# Altium schematic sheet ov2640.SchDoc
size A4
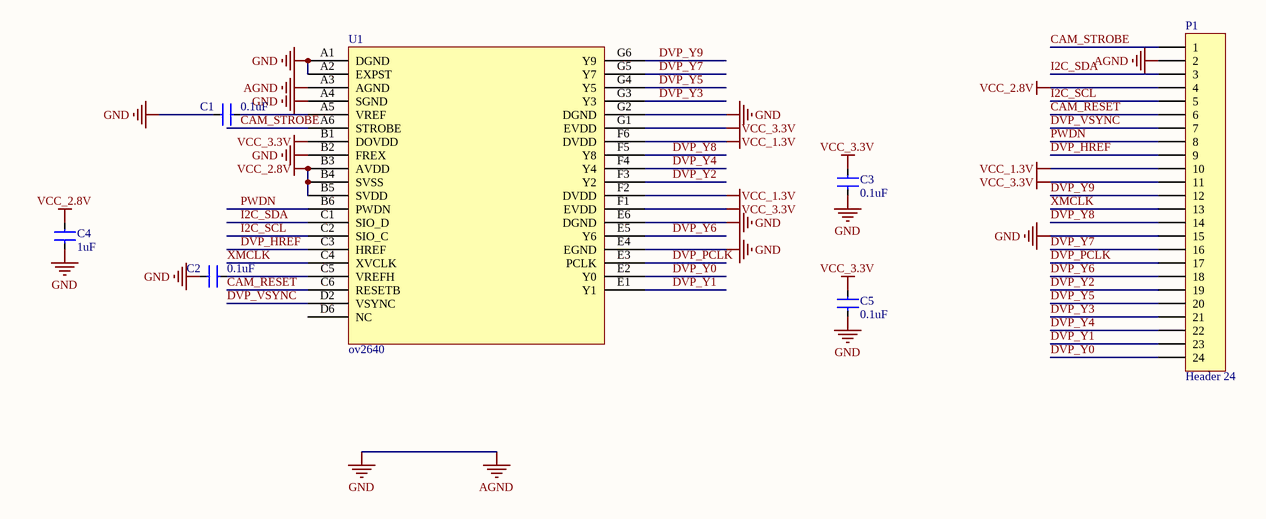
[diagram p0: ov2640.SchDoc]

## Parts
C1  0.1uF  [0402C]
C2  0.1uF  [0402C]
C3  0.1uF  [0402C]
C4  1uF  [0402C]
C5  0.1uF  [0402C]
P1  Header 24  [FPC24PIN_0.5MM]
U1  ov2640  [BGA100P9X9-81A]

## Nets
AGND: C1.1 C2.1 C3.1 C4.1 C5.1 P1.2 P1.15 U1.A1(DGND) U1.A2(EXPST) U1.A3(AGND) U1.A4(SGND) U1.B2(FREX) U1.E4(EGND) U1.E6(DGND) U1.G2(DGND)  [also labelled GND]
VCC_1.3V: P1.10 U1.F2(DVDD) U1.F6(DVDD)
VCC_2.8V: C4.2 P1.4 U1.B3(AVDD) U1.B4(SVSS) U1.B5(SVDD)
VCC_3.3V: C3.2 C5.2 P1.11 U1.B1(DOVDD) U1.F1(EVDD) U1.G1(EVDD)
CAM_RESET: P1.6 U1.C6(RESETB)
CAM_STROBE: P1.1 U1.A6(STROBE)
DVP_HREF: P1.9 U1.C3(HREF)
DVP_PCLK: P1.17 U1.E3(PCLK)
DVP_VSYNC: P1.7 U1.D2(VSYNC)
DVP_Y0: P1.24 U1.E2(Y0)
DVP_Y1: P1.23 U1.E1(Y1)
DVP_Y2: P1.19 U1.F3(Y2)
DVP_Y3: P1.21 U1.G3(Y3)
DVP_Y4: P1.22 U1.F4(Y4)
DVP_Y5: P1.20 U1.G4(Y5)
DVP_Y6: P1.18 U1.E5(Y6)
DVP_Y7: P1.16 U1.G5(Y7)
DVP_Y8: P1.14 U1.F5(Y8)
DVP_Y9: P1.12 U1.G6(Y9)
I2C_SCL: P1.5 U1.C2(SIO_C)
I2C_SDA: P1.3 U1.C1(SIO_D)
PWDN: P1.8 U1.B6(PWDN)
XMCLK: P1.13 U1.C4(XVCLK)
NetC1_2: C1.2 U1.A5(VREF)
NetC2_2: C2.2 U1.C5(VREFH)

Not connected (* = marked no-connect by the designer): U1 D6(NC)

## Library data of the parts
C1-C5 = 0.01UF: CCX85-103
P1 = Header 24: Header, 24-Pin; LatestRevisionDate: 17-Jul-2002; LatestRevisionNote: Re-released for DXP Platform.; Publisher: Altium Limited